# EAGLE design MIDImepower3 (EAGLE 6.6.0)
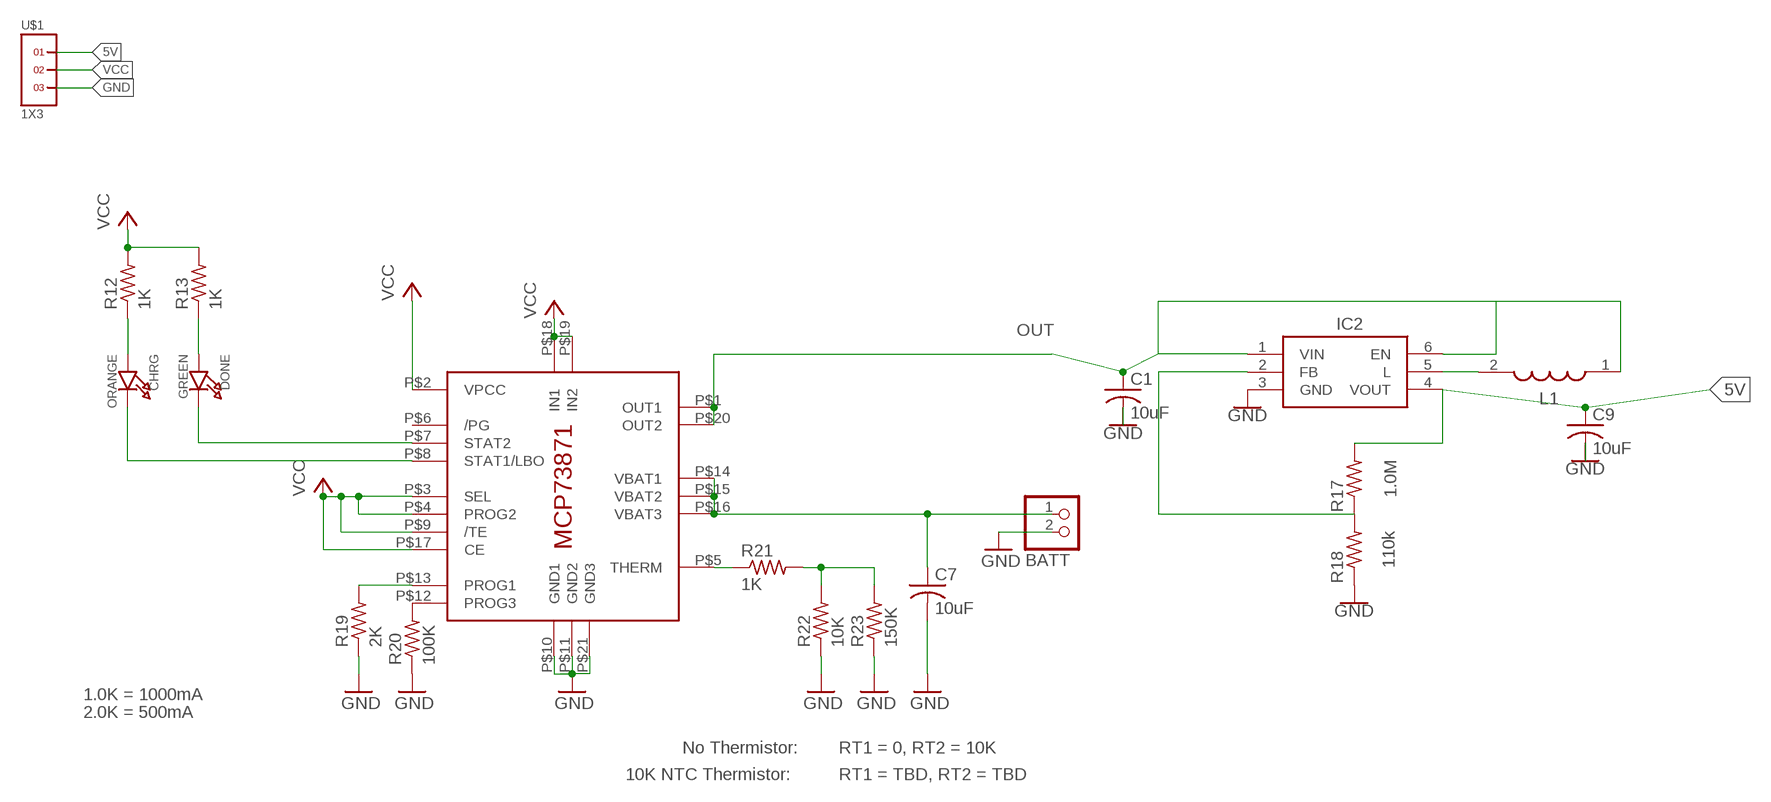
[diagram p0: schematic, sheet 1]

## Parts
BATT  JST_2PIN-SMT-RA  [JST-PH-2-SMT-RA]
C1  10uF  C-USC0805K  [C0805K]
C7  10uF  C-USC0805K  [C0805K]
C9  10uF  C-USC0805K  [C0805K]
CHRG  ORANGE  LED0805_NOOUTLINE  [CHIPLED_0805_NOOUTLINE]
DONE  GREEN  LED0805_NOOUTLINE  [CHIPLED_0805_NOOUTLINE]
IC1  MCP73871  [QFN20_4MM]
IC2  TPS61220DCKT  [SOT65P210X110-6N]
L1  EPL3015-472MLC  [EPL3015472MLC]
R12  1K  R-US_R0402  [R0402]
R13  1K  R-US_R0402  [R0402]
R17  1.0M  R-US_R0402  [R0402]
R18  110k  R-US_R0402  [R0402]
R19  2K  R-US_R0402  [R0402]
R20  100K  R-US_R0402  [R0402]
R21  1K  R-US_R0402  [R0402]
R22  10K  R-US_R0402  [R0402]
R23  150K  R-US_R0402  [R0402]
U$1  1X3  [1X3]

## Nets
5V: C9.1 IC2.4(VOUT) R17.2 U$1.1
BAT: BATT.1 C7.1 IC1.P$14(VBAT1) IC1.P$15(VBAT2) IC1.P$16(VBAT3)
GND: BATT.2 C1.2 C7.2 C9.2 IC1.P$10(GND1) IC1.P$11(GND2) IC1.P$21(GND3) IC2.3(GND) R18.1 R19.1 R20.1 R22.1 R23.1 U$1.3
N$13: DONE.C IC1.P$7(STAT2)
N$14: IC2.2(FB) R17.1 R18.2
N$15: IC2.5(L) L1.2
N$16: CHRG.C IC1.P$8(STAT1/LBO)
N$18: CHRG.A R12.1
N$20: DONE.A R13.1
N$22: IC1.P$12(PROG3) R20.2
N$23: IC1.P$13(PROG1) R19.2
N$24: IC1.P$5(THERM) R21.1
N$25: R21.2 R22.2 R23.2
OUT: C1.1 IC1.P$1(OUT1) IC1.P$20(OUT2) IC2.1(VIN) IC2.6(EN) L1.1
VCC: IC1.P$2(VPCC) IC1.P$3(SEL) IC1.P$4(PROG2) IC1.P$9(/TE) IC1.P$17(CE) IC1.P$18(IN1) IC1.P$19(IN2) R12.2 R13.2 U$1.2
Unconnected: IC1.P$6(/PG)

## Notes on the sheet
- 1.0K = 1000mA
- 2.0K = 500mA
- No Thermistor: | RT1 = 0, RT2 = 10K
- 10K NTC Thermistor: | RT1 = TBD, RT2 = TBD

## Library data of the parts
BATT = adafruit:JST_2PIN: JST 2-Pin Connectors of various flavors SMT-RA (S2B-PH-SM4) 4UConnector #17311 SMT (B2B-PH-SM4) THM-RA (S2B-PH) THM (B2B-PH)
C1 C7 C9 = adafruit:C-US: CAPACITOR, American symbol
CHRG DONE = microbuilder:LED: LED 0603 - 0603 Surface Mount Package 2mA: Green LED - Low Power (3.9mcd, 2ma, 1.7Vf) - Digikey: 475-2709-2-ND Orange LED - Low Power (9.8mcd, 2ma, 1.8Vf) - Digikey: 475-1194-2-ND Red LED - Low Power (5mcd, 2ma, 1.8Vf) - Digikey: 475-1195-2-ND Yellow LED - Low Power (7mcd, 2ma, 1.8Vf) - Digikey: 475-1196-2-ND 5mA: Blue LED - Low Power (17mcd, 5ma, 2.9Vf) - Digikey: LNJ937W8CRACT-ND 0805 - 0805 Surface Mount Package 2mA: Red LED (8.8mcd, 2mA, 1.8Vf, Clear) - Low Power [Digikey: 475-2510-1-ND] Green LED (5mcd, 2mA, 1.8Vf, Clear) - Low Power [Digikey: 475-2730-1-ND] Yellow LED (11.3mcd, 2mA, 1.8Vf, Clear) - Low Power [Digikey: 475-2555-1-ND] 20mA: Red LED (104mcd, 20mA, Diffused) - LS R976 [Digikey: 475-1278-6-ND] Red LED (12mcd, 20mA, 2.0Vf, Clear) - APT2012EC [Digikey: 754-1128-1-ND] Green LED (15mcd, 20mA, 2.2Vf, Clear) - APT2012GC [Digikey: 754-1131-1-ND] Orange LED (160mcd, 20mA, 2.1Vf, Clear) - APT2012SECK [Digikey: 754-1130-1-ND] 1206 - 1206 Surface Mount Package Green LED (26mcd, 20mA, Diffused) - LG N971 [Digikey: 475-1407-6-ND] Red LED (15mcd, 20mA, Diffused) - LH N974 [Digikey: 475-1416-6-ND] Cree - Cree High-Power Surface Mount LEDs XPEBWT-L1-0000-00D50 - White 111lm 350mA 2.9Vf 6200K 110° XTEAWT-00-0000-00000LEE3 - White 114lm 350mA 2.85Vf 5000K 115° Everlight - Everlight 45-21 Series Surface Mount LEDs 45-21/QK2C-B2832AC2CB2/2T - Warm White 2000mcd 20mA 3.25Vf 3050K 120° 45-21/LK2C-B38452C4CB2/2T - Nuetral White 2000mcd 20mA 3.25Vf 4150K 120° 45-21/LK2C-B50634C6CB2/2T - Cold White 2200mcd 20mA 3.25Vf 5650K 120° PLCC2 Reverse Mount LS T77K-J1L2-1-0-2-R18-Z - Red 11.25mcd 2mA 1.8Vf 630nm 120° LO T77K-L1M2-24-Z - Orange 19.6mcd 2mA 1.8Vf 606nm 120° LY T77K-K2M1-26-Z - Yellow 15.7mcd 2mA 1.8Vf 587nm 120°
IC1 = adafruit:MCP73871
IC2 = TPS61220DCKT:TPS61220DCKT: TPS61220DCKT, Boost Converter, Step Up 0.5A Adjustable, 1.8 5.5 V, 2000 kHz, 6-Pin SC-70 Source: Datasheet <http://www.ti.com/lit/ds/symlink/tps61220.pdf>; DESCRIPTION: TPS61220DCKT, Boost Converter, Step Up 0.5A Adjustable, 1.8 5.5 V, 2000 kHz, 6-Pin SC-70; HEIGHT: 1.1mm; MANUFACTURER_NAME: Texas Instruments; MANUFACTURER_PART_NUMBER: TPS61220DCKT; MOUSER_PART_NUMBER: 595-TPS61220DCKT; MOUSER_PRICE-STOCK: https://www.mouser.co.uk/ProductDetail/Texas-Instruments/TPS61220DCKT?qs=IDSsxkoac0ypaTy0rQZWDA%3D%3D
L1 = EPL3015-472MLC:EPL3015-472MLC: Power Inductors - SMD 4.7uH Shld 20% 1.4A 167mOhms AECQ2 Source: Datasheet <https://www.coilcraft.com/en-us/products/power/shielded-inductors/molded-inductor/epl/epl3015/epl3015-472/>; DESCRIPTION: Power Inductors - SMD 4.7uH Shld 20% 1.4A 167mOhms AECQ2; HEIGHT: 1.55mm; MANUFACTURER_NAME: COILCRAFT; MANUFACTURER_PART_NUMBER: EPL3015-472MLC; MOUSER_PART_NUMBER: 994-EPL3015-472MLC; MOUSER_PRICE-STOCK: https://www.mouser.co.uk/ProductDetail/Coilcraft/EPL3015-472MLC?qs=zCSbvcPd3pbkmCtVqRBWqg%3D%3D
R12 R13 R19-R23 = adafruit:R-US_: RESISTOR, American symbol
R17 R18 = rcl:R-US_: RESISTOR, American symbol
U$1 = headers(2mm):1X3

## Board
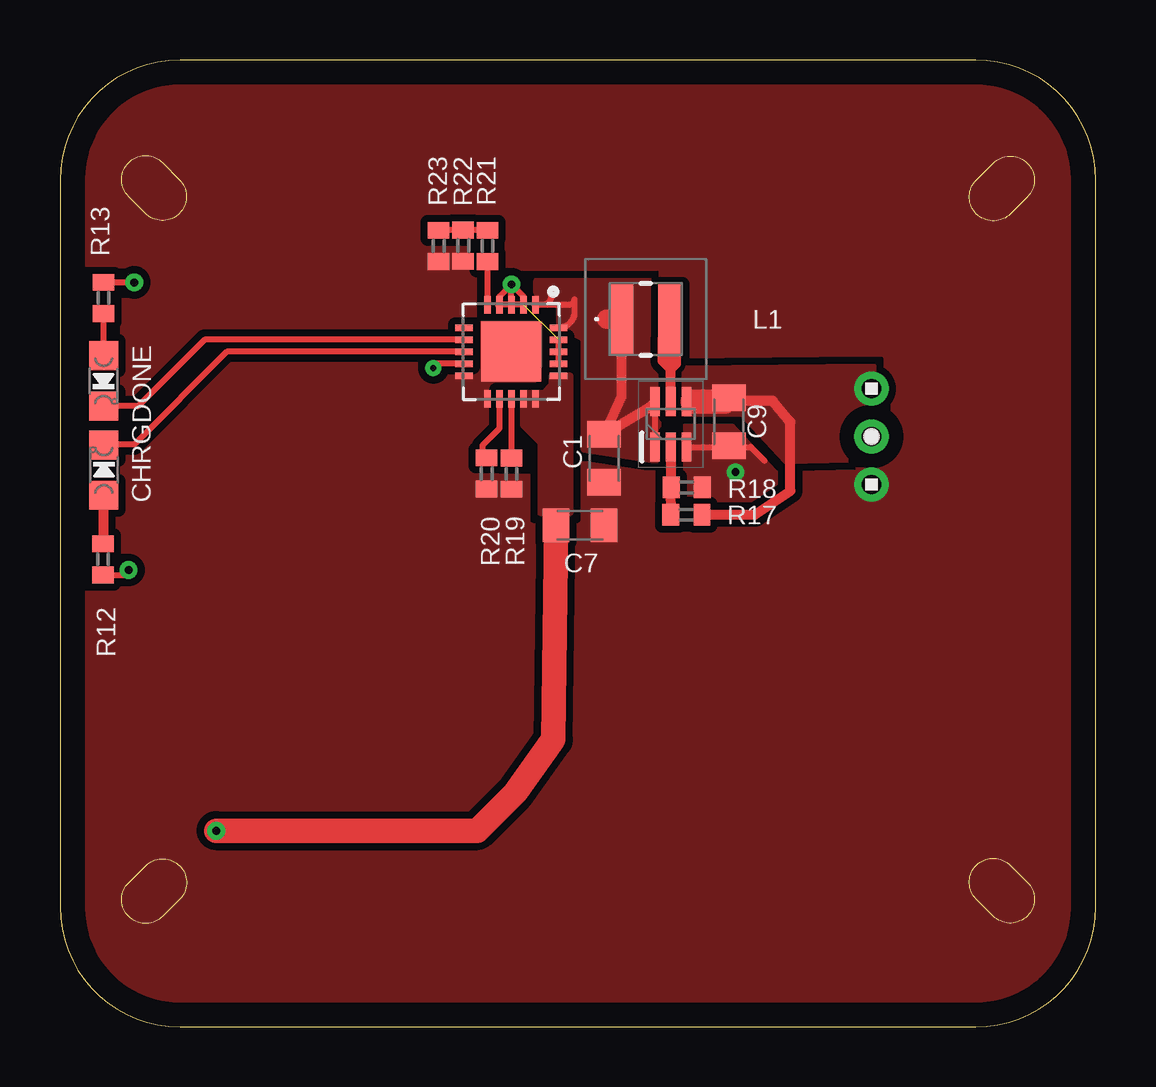
[diagram p1: board, top side]
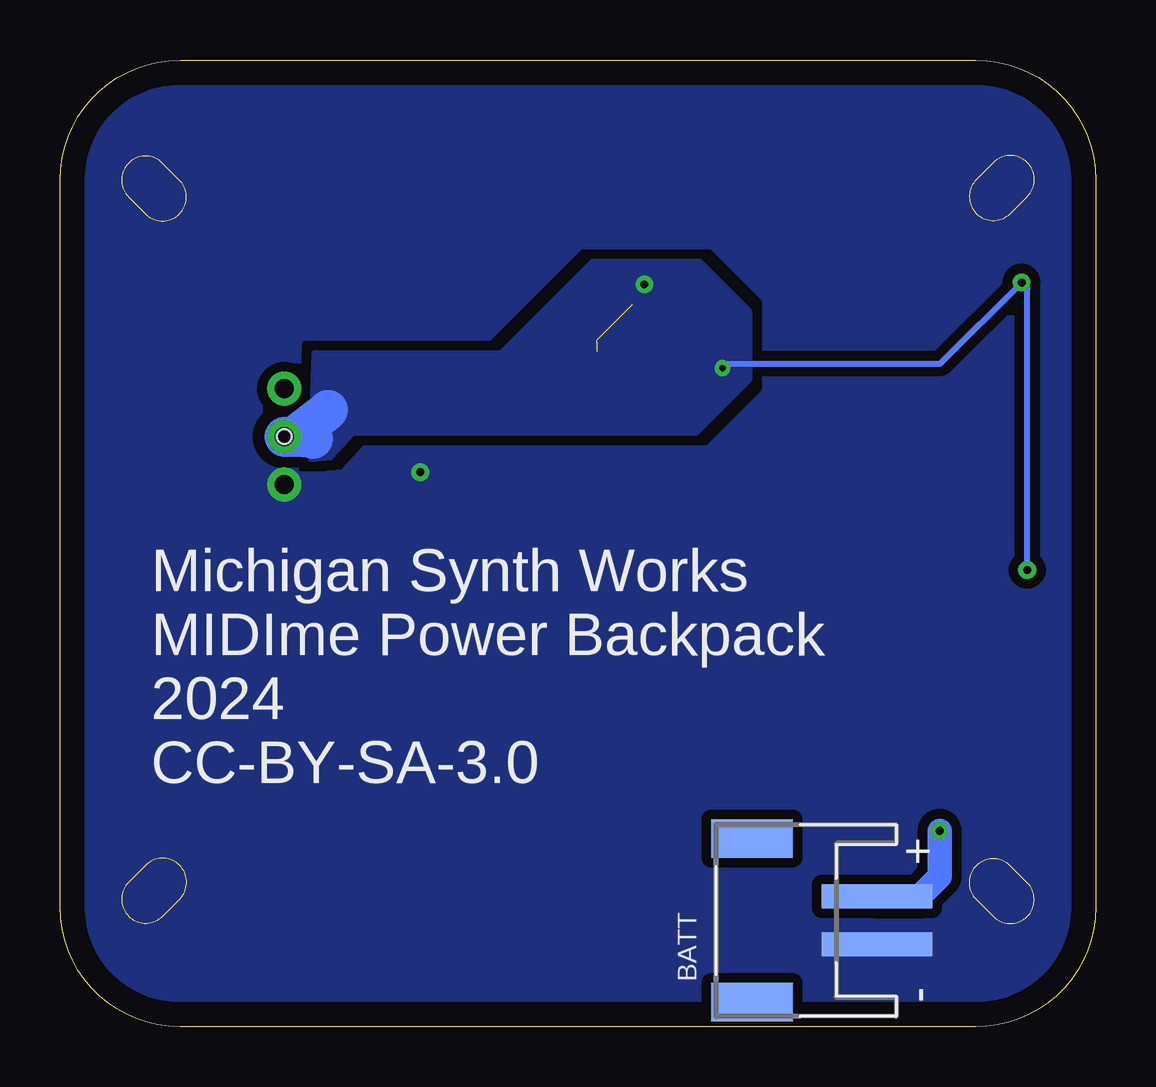
[diagram p2: board, bottom side, seen from below]

Size 43.16 x 40.31 mm. Coordinates in mm from the lower left corner, seen from the top.
Outline: 0,35.31 0,5 arc90 5,0 38.16,0 arc90 43.16,5 43.16,35.31 arc90 38.16,40.31 5,40.31 arc90 0,35.31
Copper layers (1*16): Top 0.035mm / dielectric 1.5mm / Bottom 0.035mm
Design rules "default": minimum track width 10mil, minimum drill 24mil, track to track 8mil, track to pad 8mil, pad to pad 8mil, via to via 8mil, smd to smd 8mil, copper to edge 40mil, drill to drill 8mil, minimum pad ring 10mil, minimum via ring 8mil, stop-mask expansion 4mil, vias tented up to drill 25mil, thermal gap 10mil
Holes 0.6 mm at 33.81,24.61
Milling: 24 lines

### Footprints (pad centres in the part's own frame; a part is rotated, then mirrored left to right if it is on the bottom)
JST-PH-2-SMT-RA = smd 1 x 4.6: 1 1,-3.7; 2 -1,-3.7 | smd 1.6 x 3.4: NC1 -3.4,1.5; NC2 3.4,1.5
C0805K = smd 1.1 x 1.4: 1 -1,0; 2 1,0
CHIPLED_0805_NOOUTLINE = smd 1.2 x 1.2: A 0,-1.05; C 0,1.05
QFN20_4MM = smd 0.73 x 0.28: P$1 -1.965,1; P$2 -1.965,0.5; P$3 -1.965,0; P$4 -1.965,-0.5; P$5 -1.965,-1; P$11 1.965,-1; P$12 1.965,-0.5; P$13 1.965,0; P$14 1.965,0.5; P$15 1.965,1 | smd 0.28 x 0.73: P$6 -1,-1.965; P$7 -0.5,-1.965; P$8 0,-1.965; P$9 0.5,-1.965; P$10 1,-1.965; P$16 1,1.965; P$17 0.5,1.965; P$18 0,1.965; P$19 -0.5,1.965; P$20 -1,1.965 | smd 2.5 x 2.5: P$21 0,0
SOT65P210X110-6N = smd 1.2 x 0.4: 1 -0.95,0.65; 2 -0.95,0; 3 -0.95,-0.65; 4 0.95,-0.65; 5 0.95,0; 6 0.95,0.65
EPL3015472MLC = smd 1 x 2.9: 1 -1.015,0; 2 1.015,0
R0402 = smd 0.7 x 0.9: 1 -0.65,0; 2 0.65,0
1X3 = drill 0.8 pad 1.422: 1 -2,0; 2 0,0; 3 2,0

### Placement (x,y rotation side)
BATT  12.83,4.44 90 bottom
C1  22.67,23.71 270 top
C7  21.67,20.91 0 top
C9  27.87,25.23 270 top
CHRG  1.83,23.21 0 top
DONE  1.82,26.93 180 top
IC1  18.81,28.14 270 top
IC2  25.45,25.13 90 top
L1  24.41,29.51 0 top
R12  1.79,19.49 270 top
R13  1.81,30.39 90 top
R17  26.1,21.35 0 top
R18  26.11,22.49 180 top
R19  18.81,23.06 90 top
R20  17.78,23.07 90 top
R21  17.81,32.56 90 top
R22  16.8,32.57 90 top
R23  15.78,32.56 90 top
U$1  33.81,24.61 270 top

### Tracks (layer width: path | path; a pad name or v marks a point on that pad's centre or on a via)
5V
  Top 0.406: R17.2 28.96,21.35 30.43,22.34 30.43,25.22 29.71,26.1 27.89,26.1 C9.1 27.86,26.08 27.69,26.08 IC2.4
  Top 1.016: 27.69,26.08 26.37,26.08 26.36,26.07
  pour Top (no thermals): 26.04,25.56 26.04,27.46 33.89,27.54 33.81,23.65 30.24,23.57 28.42,25.56
BAT  (via drill 0.33)
  Top 1.016: v6.51,8.18 17.38,8.18 18.97,9.76 20.55,11.99 C7.1
  Bottom 1.016: BATT.1 7.33,5.45 6.51,6.27 v6.51,8.18
  pour Top (no thermals): 19.29,26.43 19.29,25.08 20,24.37 20,21.43 21.27,21.43 21.27,27.15 20.48,27.15 20.48,26.75 20.16,26.43
GND  (via drill 0.33)
  Top 0.254: 27.98,24.4 27.75,24.18 IC2.3 28.78,24.18 29.35,23.6
  Top 0.305: 19.41,28.84 19.41,28.75 IC1.P$21
  other vias: 28.15,23.13
  pour Top (isolate 0.305, rank 2, no thermals): 43.26,35.16 43.73,5.08 arc-91 38.74,0 4.37,0 arc-90 -0.64,5 -0.64,35.57 arc-91 5.71,44.38 39.6,43.89 arc-88
  pour Bottom (isolate 0.406, rank 2, no thermals): -0.28,4.7 -0.95,35.34 arc-93 2.77,41.91 39.3,41.91 arc-92 43.02,34.22 43.33,4.85 arc-88 38.33,0 4.71,0 arc-87
N$13
  Top 0.254: IC1.P$7 6.02,28.64 3.25,25.88 DONE.C
N$14
  Top 0.406: IC2.2 25.45,22.79 R18.2 25.42,22.48 R17.1
N$15
  Top 0.406: IC2.5 25.45,27.42 25.11,27.76 25.11,28.68 25.25,28.82 25.65,28.82 25.66,28.81 25.66,27.64 25.5,27.47 25.5,28.17 25.33,28.33 25.33,29.41 L1.2
N$16
  Top 0.254: IC1.P$8 6.95,28.14 3.1,24.29 1.85,24.29 CHRG.C
N$18
  Top 0.406: CHRG.A 1.81,22.08 R12.1
N$20
  Top 0.254: R13.1 DONE.A
N$22
  Top 0.254: IC1.P$12 18.31,24.95 17.6,24.24 17.6,23.62 R20.2
N$23
  Top 0.254: IC1.P$13 R19.2
N$24
  Top 0.254: R21.1 IC1.P$5
N$25
  Top 0.254: R21.2 16.81,33.21 R22.2 R23.2
OUT
  Top 0.254: IC1.P$1 20.11,30.11 | 20.11,30.11 arc90 20.48,30.48 | 20.11,30.11 21.22,30.11 arc90 21.43,30.32 21.43,29.8 arc-90 IC1.P$20 | IC2.1 IC2.6
  Top 0.305: IC1.P$1
  Top 0.406: L1.1 23.39,26.27 C1.1 24.57,25.85 IC2.6
  Top 0.813: L1.1 22.78,29.51
  pour Top (isolate 0.305, no thermals): 19.84,31.11 24.92,31.11 24.92,23.57 21.83,24.05 21.83,28.65 20.8,29.21 20.8,30.16 19.84,30.16
VCC  (via drill 0.25, 0.33)  (3 unrouted)
  Top 0.254: IC1.P$9 15.66,27.64 v15.56,27.46 | R12.2 2.65,18.84 v2.86,19.05 | v3.1,31.04 R13.2 | IC1.P$3 18.81,30.87 v18.81,30.96 | v18.81,30.96 19.31,30.46 IC1.P$2 18.28,30.11 18.26,30.08 | IC1.P$4 18.31,30.45 v18.81,30.96 | IC1.P$17 20.77,28.55 20.8,28.57
  Top 0.305: 18.81,31.03 v18.81,30.96
  Bottom 0.254: v2.86,19.05 2.86,30.8 v3.1,31.04 6.49,27.64 15.66,27.64
  Bottom 1.676: U$1.2 33.42,24.61 | 33.42,24.61 32.7,24.61 32.62,24.53 33.42,24.61 | 33.42,24.61 31.99,25.72
  pour Bottom (isolate 0.254, no thermals): 31.91,23.73 32.7,23.65 32.54,28.1 24.77,28.1 20.95,31.91 16.51,31.91 14.45,29.84 14.45,26.99 16.67,24.77 30.96,24.77

### Text on the board
bPlace: Michigan Synth Works / MIDIme Power Backpack / 2024 / CC-BY-SA-3.0